# EAGLE design DataLoggerV2 (EAGLE 6.5.0)

## Sheet 1 of 2
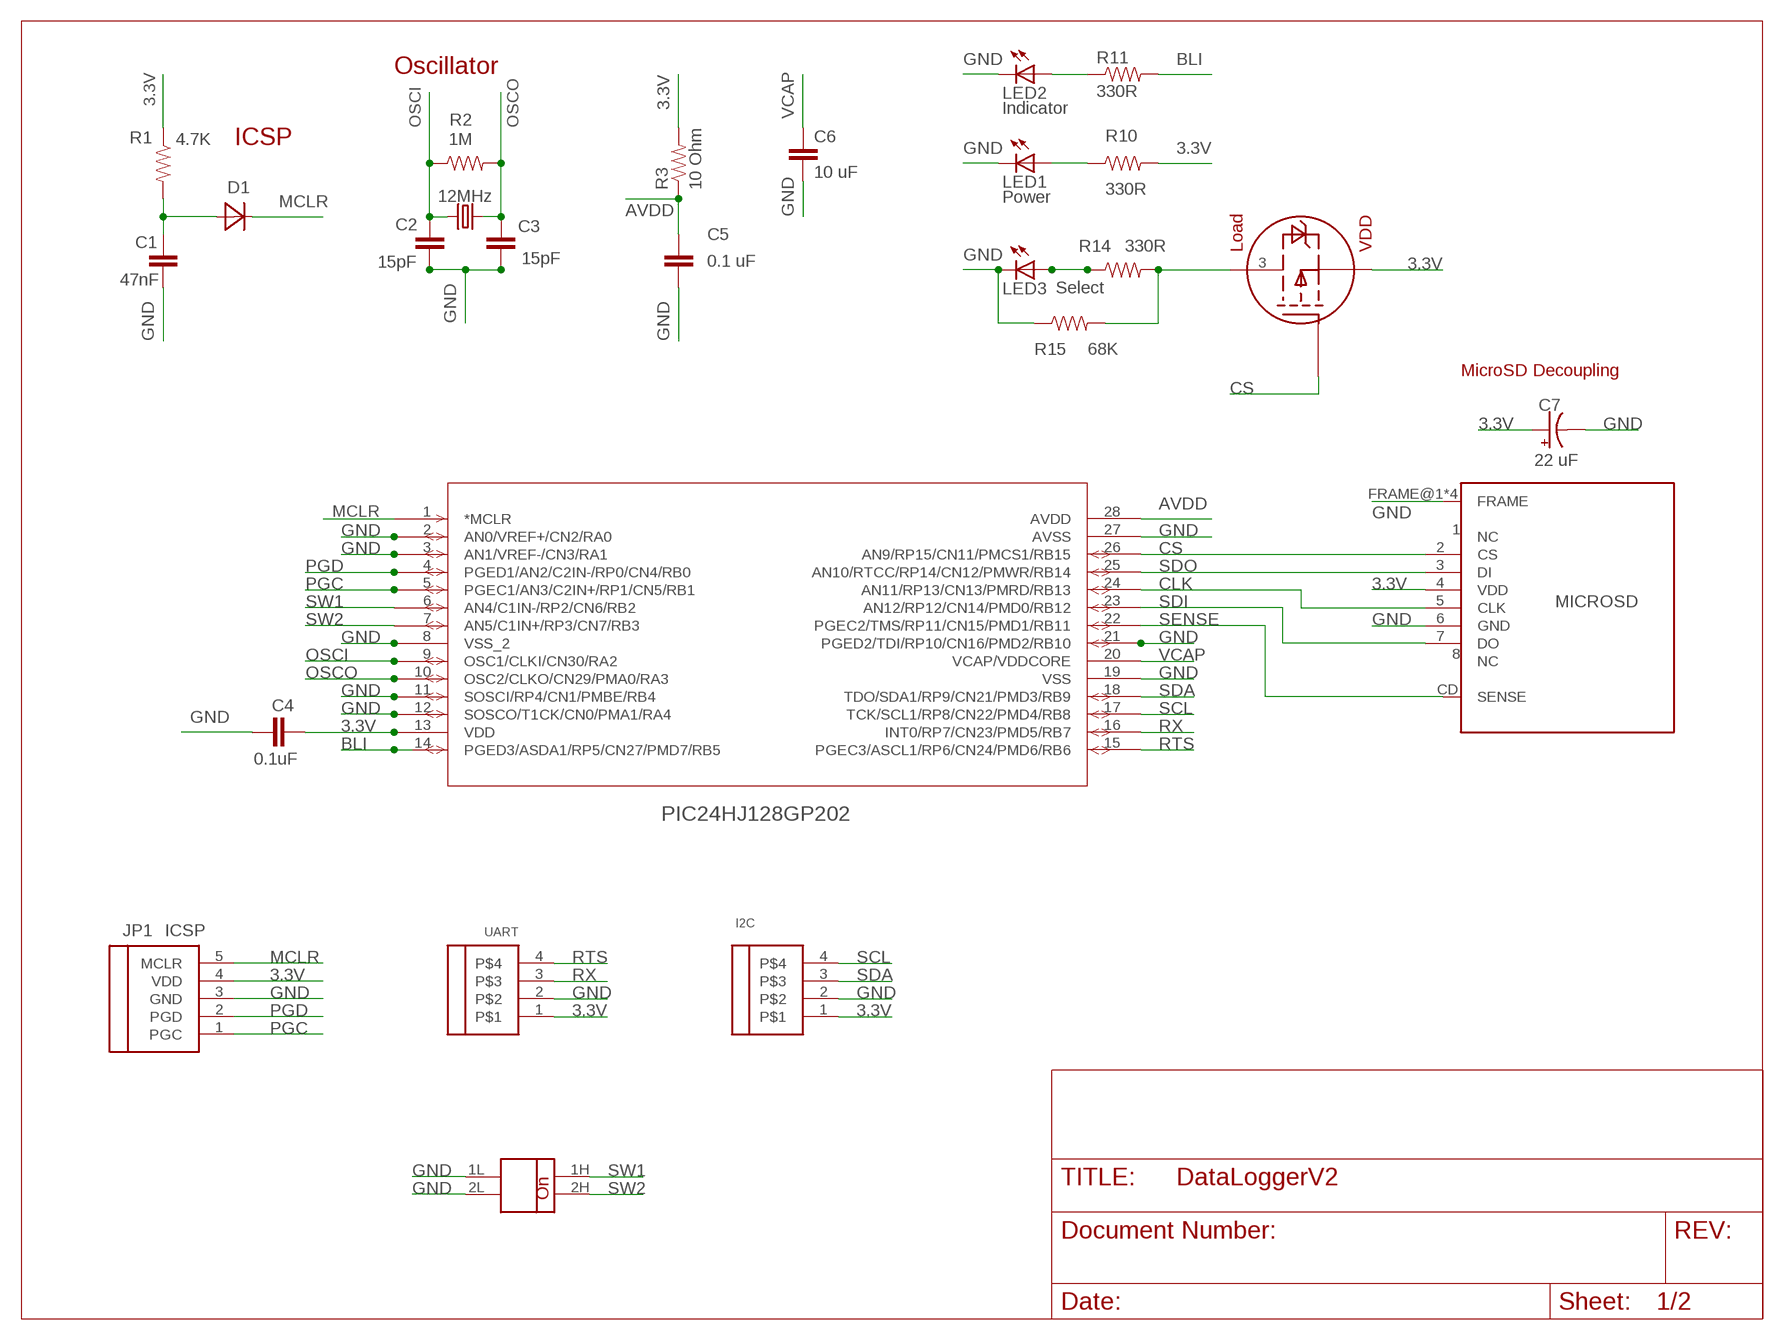
[diagram p0: schematic, sheet 1]

### Parts
C1  47nF  CAP-CERAMIC_0805  [0805_INCH-HS-CAP]
C2  15pF  CAP-CERAMIC_0805  [0805_INCH-HS-CAP]
C3  15pF  CAP-CERAMIC_0805  [0805_INCH-HS-CAP]
C4  0.1uF  CAP-CERAMIC_0603  [0603_INCH-HS-CAP]
C5  0.1 uF  CAP-CERAMIC_0603  [0603_INCH-HS-CAP]
C6  10 uF  CAP-CERAMIC_1210  [1210_INCH-HS-CAP]
C7  22 uF  CAP-SMD-TANT_C-6032  [TANT-C-6032]
D1  DIODE_1206  [1206_INCH-HS-DIODE]
I2C  HEADER-04_JST-ZH_JST-ZH  [1X04-JST-ZH]
JP1  ICSP  ICSP_JST-ZH  [1X05-JST-ZH]
LED1  Power  LED_SMD_1206  [1206_INCH-HS-LED]
LED2  Indicator  LED_SMD_1206  [1206_INCH-HS-LED]
LED3  Select  LED_SMD_1206  [1206_INCH-HS-LED]
P-FET  NTS2101P  P-MOSFET_SOT323-ONSEMI  [SOT-323-0NSEMI]
Q1  12MHz  CRYSTAL_SMD-5.0X3.2  [CRYSTAL-SMD-5.0X3.2]
R1  4.7K  RESISTOR_0805  [0805_INCH-HS]
R2  1M  RESISTOR_0805  [0805_INCH-HS]
R3  10 Ohm  RESISTOR_0805  [0805_INCH-HS]
R10  330R  RESISTOR_0805  [0805_INCH-HS]
R11  330R  RESISTOR_0805  [0805_INCH-HS]
R14  330R  RESISTOR_0805  [0805_INCH-HS]
R15  68K  RESISTOR_0805  [0805_INCH-HS]
U$1  PIC24HJ128GP202  [SOIC28-W_MC]
U$2  MICROSD  [MICROSD_V1]
U$3  SWITCH-2_HALF-PITCH  [DIP-2-HP]
UART  HEADER-04_JST-ZH_JST-ZH  [1X04-JST-ZH]

### Nets
3.3V [PWR]: C4.1 C7.+ I2C.1 JP1.4(VDD) P-FET.2(S) R1.1 R3.2 R10.2 U$1.13(VDD) U$2.4(VDD) UART.1 ; also sheet 2
AVDD: C5.1 R3.1 U$1.28(AVDD)
BLI: R11.2 U$1.14(PGED3/ASDA1/RP5/CN27/PMD7/RB5)
CLK: U$1.24(AN11/RP13/CN13/PMRD/RB13) U$2.5(CLK) ; also sheet 2
CS: P-FET.1(G) U$1.26(AN9/RP15/CN11/PMCS1/RB15) U$2.2(CS) ; also sheet 2
GND [PWR]: C1.2 C2.1 C3.1 C4.2 C5.2 C6.P$2 C7.- I2C.2 JP1.3(GND) LED1.C LED2.C LED3.C R15.1 U$1.2(AN0/VREF+/CN2/RA0) U$1.3(AN1/VREF-/CN3/RA1) U$1.8(VSS_2) U$1.11(SOSCI/RP4/CN1/PMBE/RB4) U$1.12(SOSCO/T1CK/CN0/PMA1/RA4) U$1.19(VSS) U$1.21(PGED2/TDI/RP10/CN16/PMD2/RB10) U$1.27(AVSS) U$2.6(GND) U$2.FRAME@1(FRAME) U$2.FRAME@2(FRAME) U$2.FRAME@3(FRAME) U$2.FRAME@4(FRAME) U$3.1L U$3.2L UART.2 ; also sheet 2
MCLR: D1.C JP1.5(MCLR) U$1.1(*MCLR)
N$1: C1.1 D1.A R1.2
N$2: LED3.A R14.1
N$3: LED1.A R10.1
N$4: LED2.A R11.1
N$5: P-FET.3(D) R14.2 R15.2
OSCI: C2.2 Q1.P$2 R2.1 U$1.9(OSC1/CLKI/CN30/RA2)
OSCO: C3.2 Q1.P$1 R2.2 U$1.10(OSC2/CLKO/CN29/PMA0/RA3)
PGC: JP1.1(PGC) U$1.5(PGEC1/AN3/C2IN+/RP1/CN5/RB1)
PGD: JP1.2(PGD) U$1.4(PGED1/AN2/C2IN-/RP0/CN4/RB0)
RTS: U$1.15(PGEC3/ASCL1/RP6/CN24/PMD6/RB6) UART.4 ; also sheet 2
RX: U$1.16(INT0/RP7/CN23/PMD5/RB7) UART.3 ; also sheet 2
SCL: I2C.4 U$1.17(TCK/SCL1/RP8/CN22/PMD4/RB8) ; also sheet 2
SDA: I2C.3 U$1.18(TDO/SDA1/RP9/CN21/PMD3/RB9) ; also sheet 2
SDI: U$1.23(AN12/RP12/CN14/PMD0/RB12) U$2.7(DO) ; also sheet 2
SDO: U$1.25(AN10/RTCC/RP14/CN12/PMWR/RB14) U$2.3(DI) ; also sheet 2
SENSE: U$1.22(PGEC2/TMS/RP11/CN15/PMD1/RB11) U$2.CD(SENSE)
SW1: U$1.6(AN4/C1IN-/RP2/CN6/RB2) U$3.1H
SW2: U$1.7(AN5/C1IN+/RP3/CN7/RB3) U$3.2H
VCAP: C6.P$1 U$1.20(VCAP/VDDCORE)
Unconnected: U$2.1(NC) U$2.8(NC)

### Notes on the sheet
- Oscillator
- ICSP
- MicroSD Decoupling

## Sheet 2 of 2
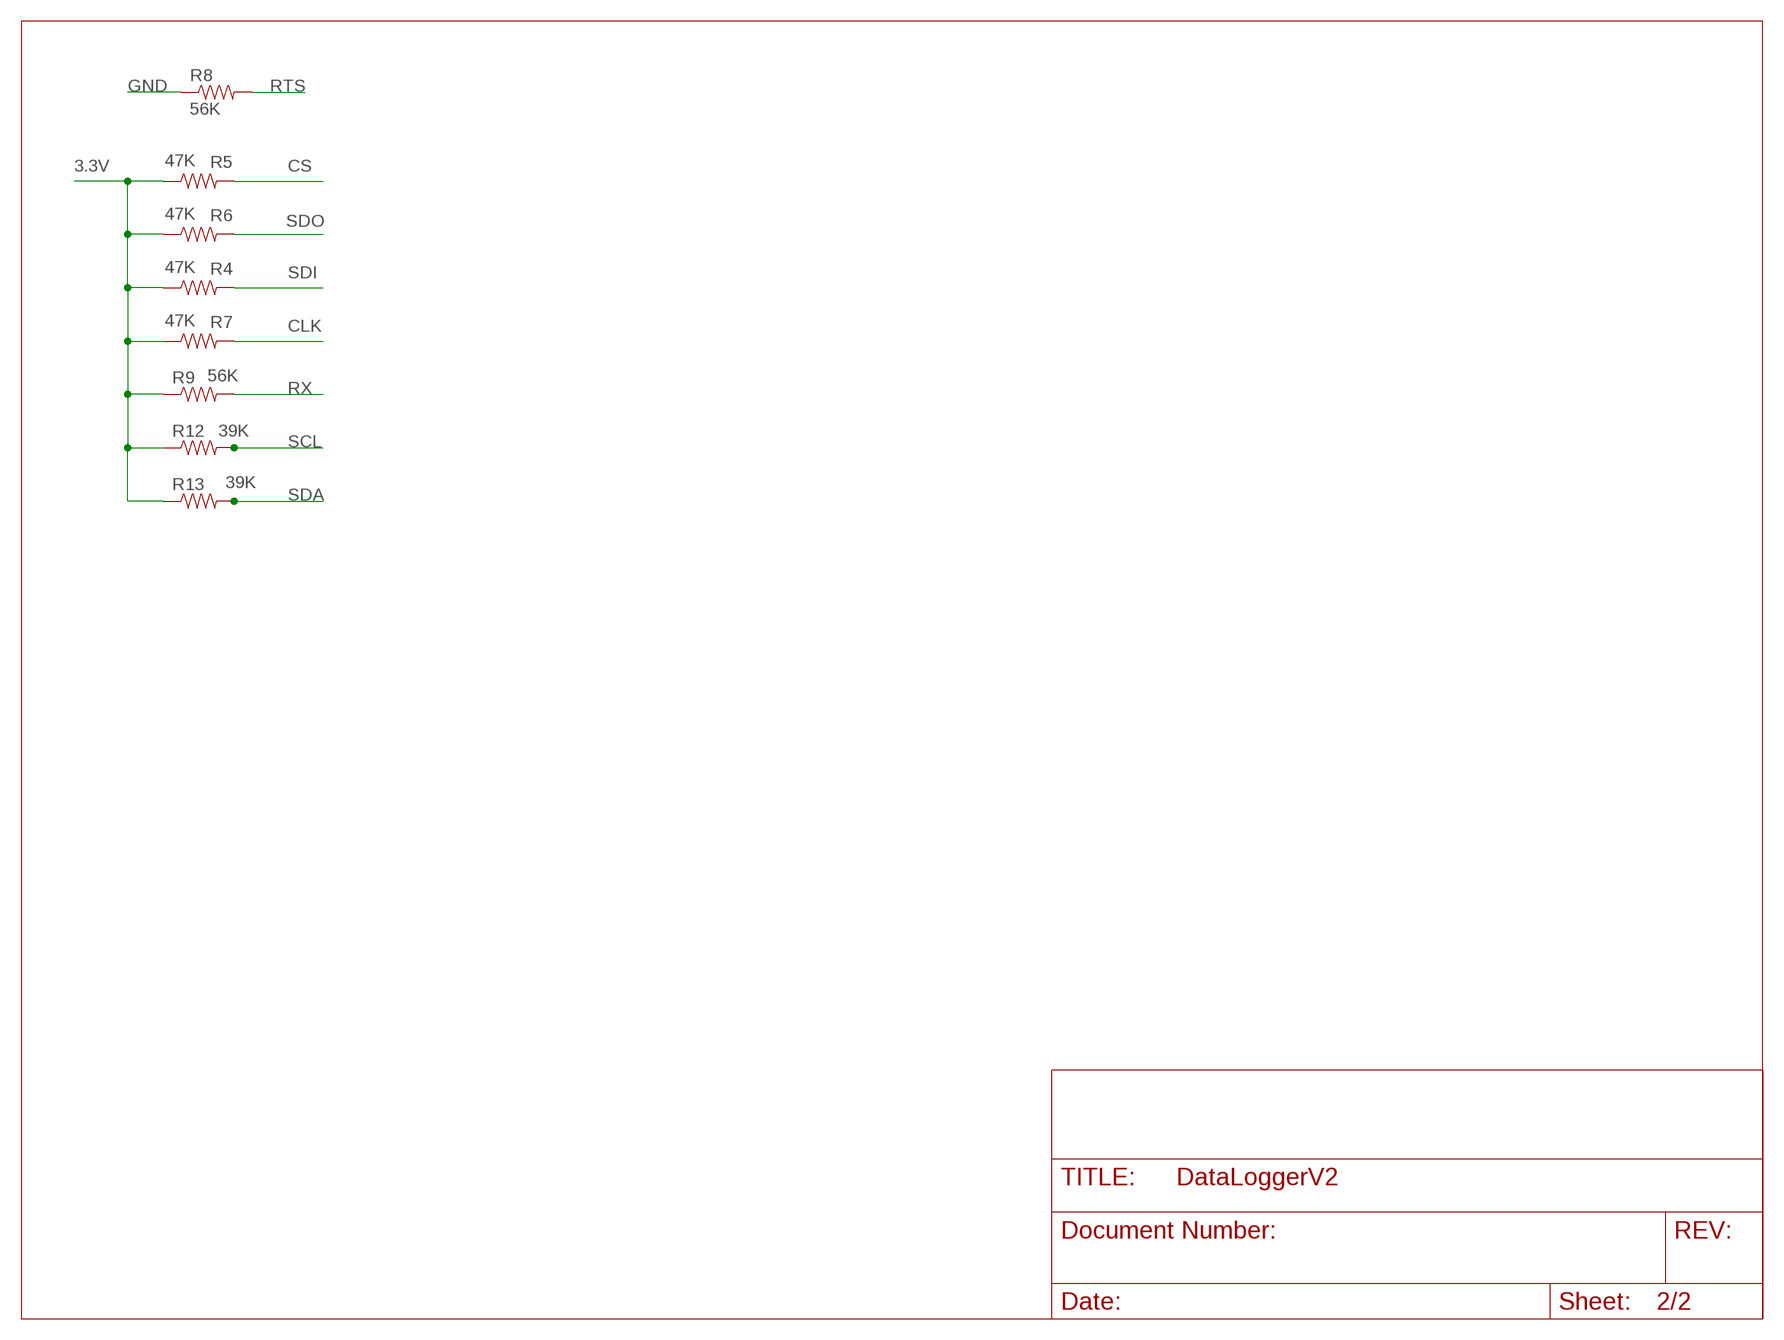
[diagram p1: schematic, sheet 2]

### Parts
R4  47K  RESISTOR_0805  [0805_INCH-HS]
R5  47K  RESISTOR_0805  [0805_INCH-HS]
R6  47K  RESISTOR_0805  [0805_INCH-HS]
R7  47K  RESISTOR_0805  [0805_INCH-HS]
R8  56K  RESISTOR_0805  [0805_INCH-HS]
R9  56K  RESISTOR_0805  [0805_INCH-HS]
R12  39K  RESISTOR_0805  [0805_INCH-HS]
R13  39K  RESISTOR_0805  [0805_INCH-HS]

### Nets
3.3V [PWR]: R4.1 R5.1 R6.1 R7.1 R9.1 R12.1 R13.1 ; also sheet 1
CLK: R7.2 ; also sheet 1
CS: R5.2 ; also sheet 1
GND [PWR]: R8.1 ; also sheet 1
RTS: R8.2 ; also sheet 1
RX: R9.2 ; also sheet 1
SCL: R12.2 ; also sheet 1
SDA: R13.2 ; also sheet 1
SDI: R4.2 ; also sheet 1
SDO: R6.2 ; also sheet 1

## Library data of the parts
C1-C6 = AZ Custom:CAP-CERAMIC: Ceramic Capacitor
C7 = AZ Custom:CAP-SMD-TANT
D1 = AZ Custom:DIODE: Diode
I2C UART = AZ Custom:HEADER-04
JP1 = AZ Custom:ICSP: ICSP Header
LED1-LED3 = AZ Custom:LED: LEDs Standard schematic elements and footprints for 5mm, 3mm, 1206, and 0603 sized LEDs. 5mm - Spark Fun Electronics SKU : COM-00529 (and others)
P-FET = AZ Custom:P-MOSFET: P-channel MOSFET NOTE: Source is connected to VDD, load is connected to Drain. ON when Gate at GND, OFF when Gate at VDD
Q1 = AZ Custom:CRYSTAL: Crystals Various standard crystals. Proven footprints. Spark Fun Electronics SKU : COM-00534
R1-R15 = AZ Custom:RESISTOR
U$1 = AZ Custom:PIC24HJ128GP202
U$2 = AZ Custom:MICROSD
U$3 = AZ Custom:SWITCH-2: 2 contact pair switch

## Net classes
0 default: width 0.203 mm, clearance 0.203 mm
2 PWR: width 0.406 mm, clearance 0.406 mm

## Board
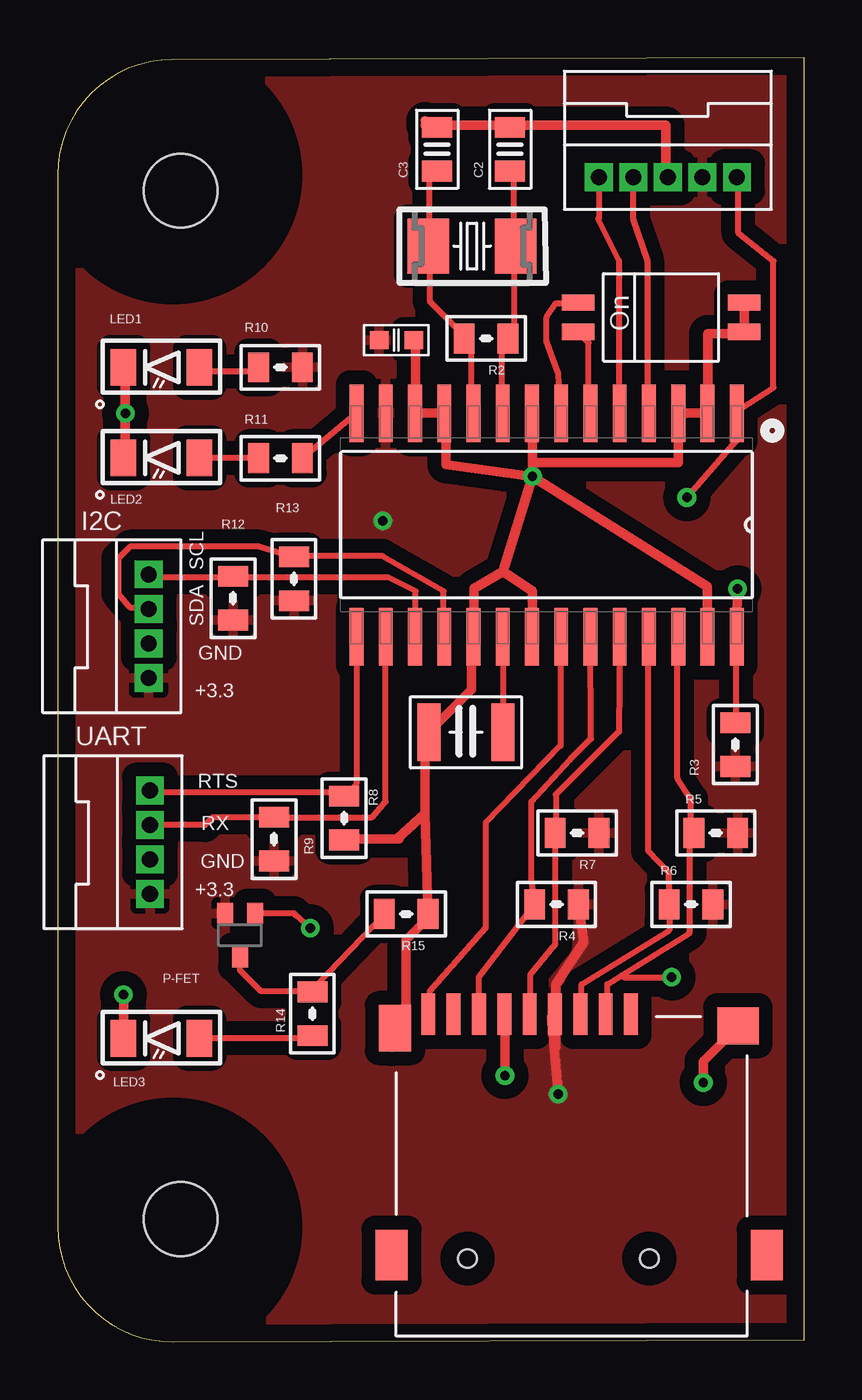
[diagram p2: board, top side]
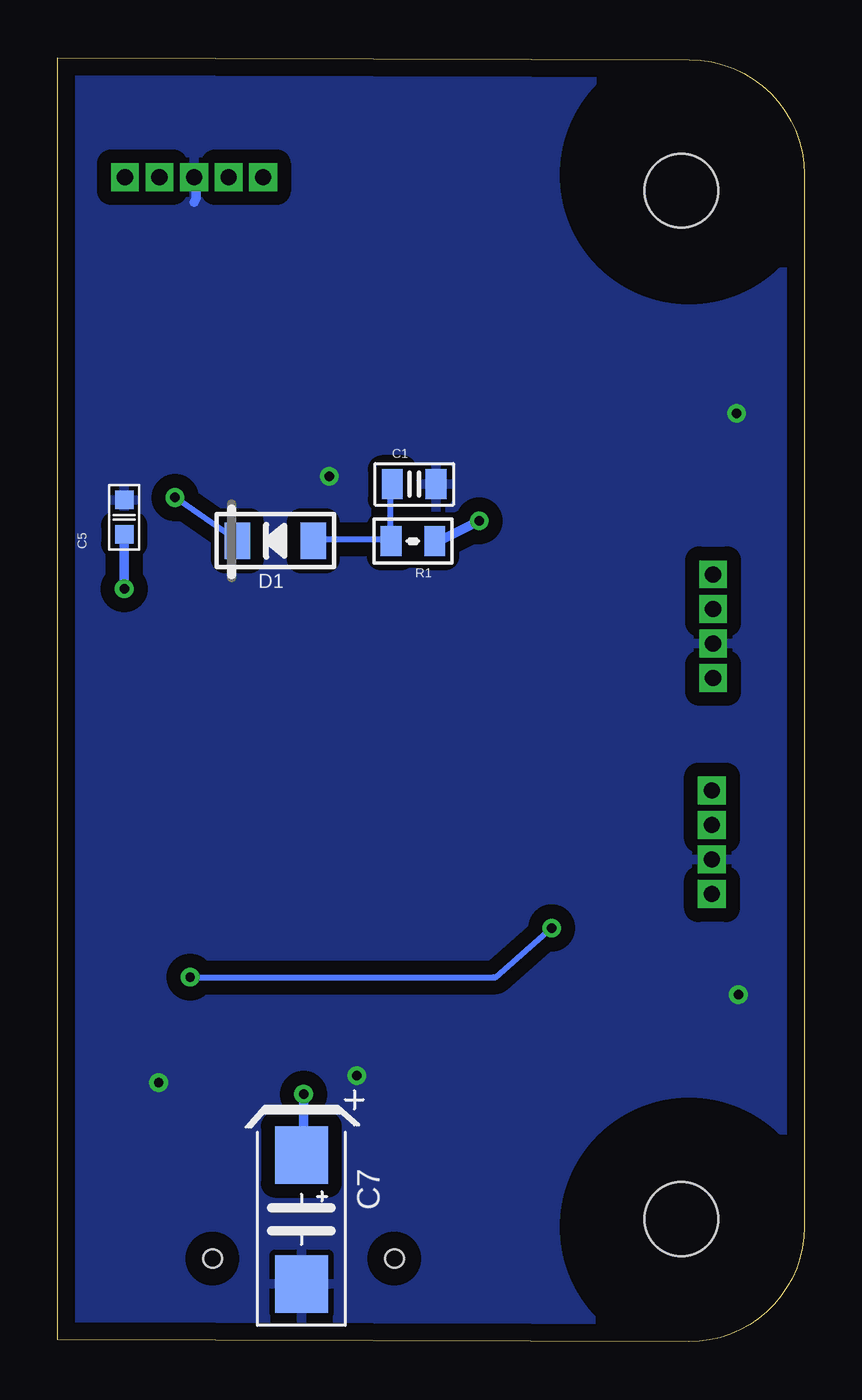
[diagram p3: board, bottom side, seen from below]

Size 32.43 x 55.76 mm. Coordinates in mm from the lower left corner, seen from the top.
Outline: 32.43,55.76 4.99,55.68 arc90 0,50.68 0,5 arc90 5.01,0 32.43,0.08 32.43,55.76
Copper layers (1*16): Top 0.035mm / dielectric 1.5mm / Bottom 0.035mm
Design rules "AZCustom *": minimum track width 10mil, minimum drill 16mil, track to track 8mil, track to pad 8mil, pad to pad 8mil, via to via 8mil, smd to smd 8mil, copper to edge 30mil, drill to drill 12mil, minimum pad ring 10mil, minimum via ring 8mil, stop-mask expansion 4mil, vias tented up to drill 25mil, thermal gap 10mil
Holes 3.2 mm at 5.35,5.33 5.35,49.98
tRestrict: area 0,0 to 10,10; area 0,45.7 to 10,55.7
bRestrict: area 0,45.7 to 10,55.7; area 0,0 to 10,10

### Footprints (pad centres in the part's own frame; a part is rotated, then mirrored left to right if it is on the bottom)
0805_INCH-HS-CAP = smd 0.9 x 1.3: 1 -0.95,0; 2 0.95,0
0603_INCH-HS-CAP = smd 0.8 x 0.8: 1 -0.75,0; 2 0.75,0
1210_INCH-HS-CAP = smd 1 x 2.5: P$1 -1.6,0; P$2 1.6,0
TANT-C-6032 = smd 2.5 x 2.3: + -2.8,0; - 2.8,0
1206_INCH-HS-DIODE = smd 1.1 x 1.6: A -1.65,0; C 1.65,0
1X04-JST-ZH = drill 0.7 pad 0.991 square: 1 -2.25,0; 2 -0.75,0; 3 0.75,0; 4 2.25,0
1X05-JST-ZH = drill 0.7 pad 1.016 square: 1 -3,0; 2 -1.5,0; 3 0,0; 4 1.5,0; 5 3,0
1206_INCH-HS-LED = smd 1.1 x 1.6: A -1.65,0; C 1.65,0
SOT-323-0NSEMI = smd 0.7 x 0.9: 1 -0.65,-0.95; 2 0.65,-0.95; 3 0,0.95
CRYSTAL-SMD-5.0X3.2 = smd 1.8 x 2.4: P$1 -1.9,0; P$2 1.9,0
0805_INCH-HS = smd 0.9 x 1.3: 1 -0.95,0; 2 0.95,0
SOIC28-W_MC = smd 2.5 x 0.6: 1 -4.85,8.255; 2 -4.85,6.985; 3 -4.85,5.715; 4 -4.85,4.445; 5 -4.85,3.175; 6 -4.85,1.905; 7 -4.85,0.635; 8 -4.85,-0.635; 9 -4.85,-1.905; 10 -4.85,-3.175; 11 -4.85,-4.445; 12 -4.85,-5.715; 13 -4.85,-6.985; 14 -4.85,-8.255; 15 4.85,-8.255; 16 4.85,-6.985; 17 4.85,-5.715; 18 4.85,-4.445; 19 4.85,-3.175; 20 4.85,-1.905; 21 4.85,-0.635; 22 4.85,0.635; 23 4.85,1.905; 24 4.85,3.175; 25 4.85,4.445; 26 4.85,5.715; 27 4.85,6.985; 28 4.85,8.255
MICROSD_V1 = smd 1.8 x 0.6: 1 -6.35,2.58; 2 -6.35,1.48; 3 -6.35,0.38; 4 -6.35,-0.72; 5 -6.35,-1.82; 6 -6.35,-2.92; 7 -6.35,-4.02; 8 -6.35,-5.12; CD -6.35,-6.22 | smd 2.2 x 1.4: FRAME@1 4.1,8.48; FRAME@2 4.1,-7.82 | smd 2 x 1.4: FRAME@3 -5.75,-7.67 | smd 1.6 x 1.8: FRAME@4 -5.85,7.23 | hole 0.8: 4.25,3.38; 4.25,-4.52
DIP-2-HP = smd 0.7 x 1.4: 1H -0.635,3.6; 1L -0.635,-3.6; 2H 0.635,3.6; 2L 0.635,-3.6

### Placement (x,y rotation side)
C1  16.94,37.24 0 bottom
C2  19.66,51.78 270 top
C3  16.48,51.78 270 top
C4  14.71,43.49 0 top
C5  29.53,35.8 90 bottom
C6  17.74,26.47 180 top
C7  21.84,5.32 270 bottom
D1  22.97,34.78 180 bottom
I2C  3.96,31.07 90 top
JP1  26.5,50.57 0 top
LED1  4.51,42.31 180 top
LED2  4.51,38.38 180 top
LED3  4.51,13.18 180 top
P-FET  7.92,17.66 180 top
Q1  18,47.57 0 top
R1  17,34.77 180 bottom
R2  18.61,43.57 180 top
R3  29.43,25.94 270 top
R4  21.67,19 180 top
R5  28.58,22.1 180 top
R6  27.51,19 180 top
R7  22.56,22.1 180 top
R8  12.45,22.74 90 top
R9  9.4,21.83 90 top
R10  9.68,42.31 0 top
R11  9.68,38.37 0 top
R12  7.62,32.29 90 top
R13  10.26,33.13 90 top
R14  11.07,14.25 90 top
R15  15.14,18.58 180 top
U$1  21.24,35.47 270 top
U$2  22.32,7.87 270 top
U$3  26.21,44.49 90 top
UART  4.01,21.69 90 top

### Tracks (layer width: path | path; a pad name or v marks a point on that pad's centre or on a via)
3.3V  (via drill 0.41)
  Top 0.406: R7.1 23.47,22.13 23.49,22.07 | 21.64,12.79 21.64,14.31 | 21.64,14.31 21.64,15.53 22.86,17.36 R4.1 | 21.64,14.31 U$2.4 21.44,14.11 v21.74,10.75 | 28.04,50.58 JP1.4 28.04,50.58
  Bottom 0.406: v14.12,35.65 15.95,34.73 R1.1 | v21.74,10.75 21.74,8.01 21.23,8.01 C7.+
  pour Top (isolate 0.61): 31.75,-0.02 5,-0.02 arc-90 0,4.98 0,50.86 arc-90 5,55.86 31.75,55.86
AVDD  (via drill 0.41)
  Top 0.254: R3.1 29.36,26.91 29.26,27.01 29.46,27.01 29.46,30.57 U$1.28 29.46,30.67
  Top 0.406: 29.46,30.67 v29.53,32.7
  Bottom 0.254: 29.26,34.93 C5.1
  Bottom 0.406: v29.53,32.7 C5.1
BLI
  Top 0.254: U$1.14 R11.2
CLK
  Top 0.254: 20.52,14.31 U$2.5 20.52,15.94 21.61,17.26 R7.2 21.64,22.1 21.64,23.76 24.38,26.5 U$1.24
CS  (via drill 0.41)
  Top 0.254: 24.52,15.93 23.88,15.53 23.88,14.31 U$2.2 | 24.52,15.93 27.39,17.72 27.46,17.76 27.46,22.13 R5.2 27.51,22.23 27.51,23.56 26.92,24.47 26.92,30.57 U$1.26 | v26.67,15.83 24.59,15.83 24.52,15.93 | v10.97,17.97 10.33,18.53 10.25,18.61 P-FET.1
  Bottom 0.254: v26.67,15.83 13.51,15.83 13.41,15.83 v10.97,17.97
GND  (via drill 0.41)
  Top 0.406: LED2.C 2.95,38.29 v2.95,40.32 2.95,42.15 LED1.C 3.05,42.35 | v20.62,37.58 20.62,40.32 U$1.8 | C4.2 15.54,43.47 15.54,40.52 U$1.12 U$1.11 16.87,40.32 16.87,38.08 v20.62,37.58 | U$1.27 28.22,32.8 v20.62,37.58 | 19.34,33.46 18.09,32.7 18.09,30.67 U$1.19 17.98,30.54 17.98,28.33 16.14,26.48 C6.P$2 15.95,26.4 15.95,22.95 | 19.34,33.46 v20.62,37.58 | U$1.21 20.62,32.6 19.34,33.46 | 15.95,52.82 C3.1 | 19.61,52.82 C2.1 | 15.95,53.02 C3.1 | C2.1 19.81,52.82 26.42,52.82 26.42,50.58 JP1.3 | v19.43,11.57 19.43,14.31 U$2.6 | C3.1 16.66,52.82 19.41,52.82 C2.1 | U$3.2L U$3.1L 29.81,43.77 28.25,43.77 28.25,40.32 U$1.2 U$1.3 26.95,38.19 20.62,38.19 v20.62,37.58 | 14.73,21.83 14.83,21.83 | 14.73,21.83 12.5,21.83 R8.1 | 15.95,22.95 14.73,21.83 | 15.95,22.95 R15.1 16.05,18.37 15.14,17.46 15.14,14.21 14.73,13.8 U$2.FRAME@3 14.53,13.5 14.53,12.79 | v2.86,15.07 LED3.C | v28.04,11.26 28.04,12.18 29.57,13.7
  Bottom 0.406: JP1.3 26.42,50.48 26.42,49.67 26.5,49.48
  pour Bottom (isolate 0.61): 31.75,-0.02 5,-0.02 arc-90 0,4.98 0,50.86 arc-90 5,55.86 31.75,55.86
MCLR  (via drill 0.41)
  Top 0.254: v27.33,36.66 29.46,39.1 29.46,40.32 29.57,40.32 U$1.1 29.36,40.22 29.36,40.32 31.09,41.44 31.09,46.92 29.57,48.14 29.57,50.38 29.36,50.38 29.46,50.48 JP1.5
  Bottom 0.254: D1.C 24.69,34.83 v27.33,36.66
N$1
  Bottom 0.254: C1.1 17.98,37.17 17.98,34.83 R1.2 18.09,34.83 21.23,34.83 D1.A
N$2
  Top 0.254: R14.1 10.95,13.18 LED3.A
N$3
  Top 0.254: R10.1 8.84,42.25 8.74,42.15 6.4,42.15 6.3,42.25 LED1.A
N$4
  Top 0.254: R11.1 8.64,38.39 6.2,38.39 LED2.A
N$5
  Top 0.254: P-FET.3 7.92,16.14 8.84,15.22 11.04,15.22 R14.2 11.28,15.53 R15.2
OSCI
  Top 0.254: 19.3,40.42 U$1.9 | 19.3,43.16 19.61,43.47 R2.1 | 19.3,40.52 U$1.9 | R2.1 19.3,43.06 19.3,40.62 U$1.9 | C2.2 19.71,50.78 19.81,50.68 19.81,47.63 Q1.P$2 19.81,47.53 19.81,43.88 19.61,43.67 R2.1
OSCO
  Top 0.254: 17.98,40.42 U$1.10 17.98,40.52 17.98,43.16 17.68,43.47 R2.2 17.68,43.67 16.15,45.2 16.15,47.53 Q1.P$1 16.15,47.63 16.15,50.48 16.46,50.78 C3.2
PGC
  Top 0.254: JP1.1 23.5,48.75 23.47,48.75 24.38,46.92 24.38,40.42 U$1.5
PGD
  Top 0.254: JP1.2 25,50.38 24.99,50.38 24.99,48.75 25.6,46.92 25.6,40.42 U$1.4
RTS
  Top 0.254: 12.9,30.67 U$1.15 12.98,24.23 R8.2 | 12.5,23.76 R8.2 | UART.4 4.06,23.86 12.5,23.86 R8.2
RX
  Top 0.254: 4.06,22.44 UART.3 6.4,22.44 6.74,22.78 R9.2 13.65,22.78 14.25,23.45 U$1.16
SCL
  Top 0.254: U$1.17 15.54,30.77 15.54,32.6 14.33,33.21 7.92,33.21 | 7.92,33.21 3.96,33.21 I2C.4 | 7.92,33.21 R12.2
SDA
  Top 0.254: U$1.18 16.76,30.62 16.76,32.6 14.1,34.12 10.67,34.12 R13.2 | I2C.3 3.96,31.89 3.15,31.89 3.05,31.99 2.64,32.5 2.64,34.02 3.15,34.53 8.76,34.53 R13.2 | 10.26,34.12 R13.2
SDI
  Top 0.254: 18.29,14.21 U$2.7 18.29,15.83 R4.2 20.62,19.81 20.57,20.1 20.57,23.45 22.25,25.28 23.16,26.2 U$1.23 23.06,30.57
SDO
  Top 0.254: 25.6,30.57 U$1.25 25.65,30.46 25.65,21.32 26.52,20.41 R6.2 26.56,17.87 22.76,15.53 22.76,14.31 U$2.3
SENSE
  Top 0.254: 16.15,14.31 U$2.CD | 21.84,30.57 U$1.22 | 16.15,14.41 U$2.CD | 21.84,30.46 U$1.22 | U$2.CD 16.15,14.51 16.15,15.22 18.59,17.97 18.59,22.54 21.84,25.89 21.84,30.36 U$1.22
SW1
  Top 0.254: U$3.1H 22.66,43.77 23.06,43.37 23.06,40.42 U$1.6
SW2
  Top 0.254: U$3.2H 22.55,45.09 21.64,45.09 21.23,44.49 21.23,43.47 21.44,42.86 21.74,42.05 21.84,40.42 U$1.7
VCAP
  Top 0.254: U$1.20 C6.P$1

### Text on the board
tPlace: I2C | SCL | SDA | GND | +3.3 | RTS | RX | GND | +3.3